# EAGLE schematic pirFadeDC (EAGLE 7.7.0)
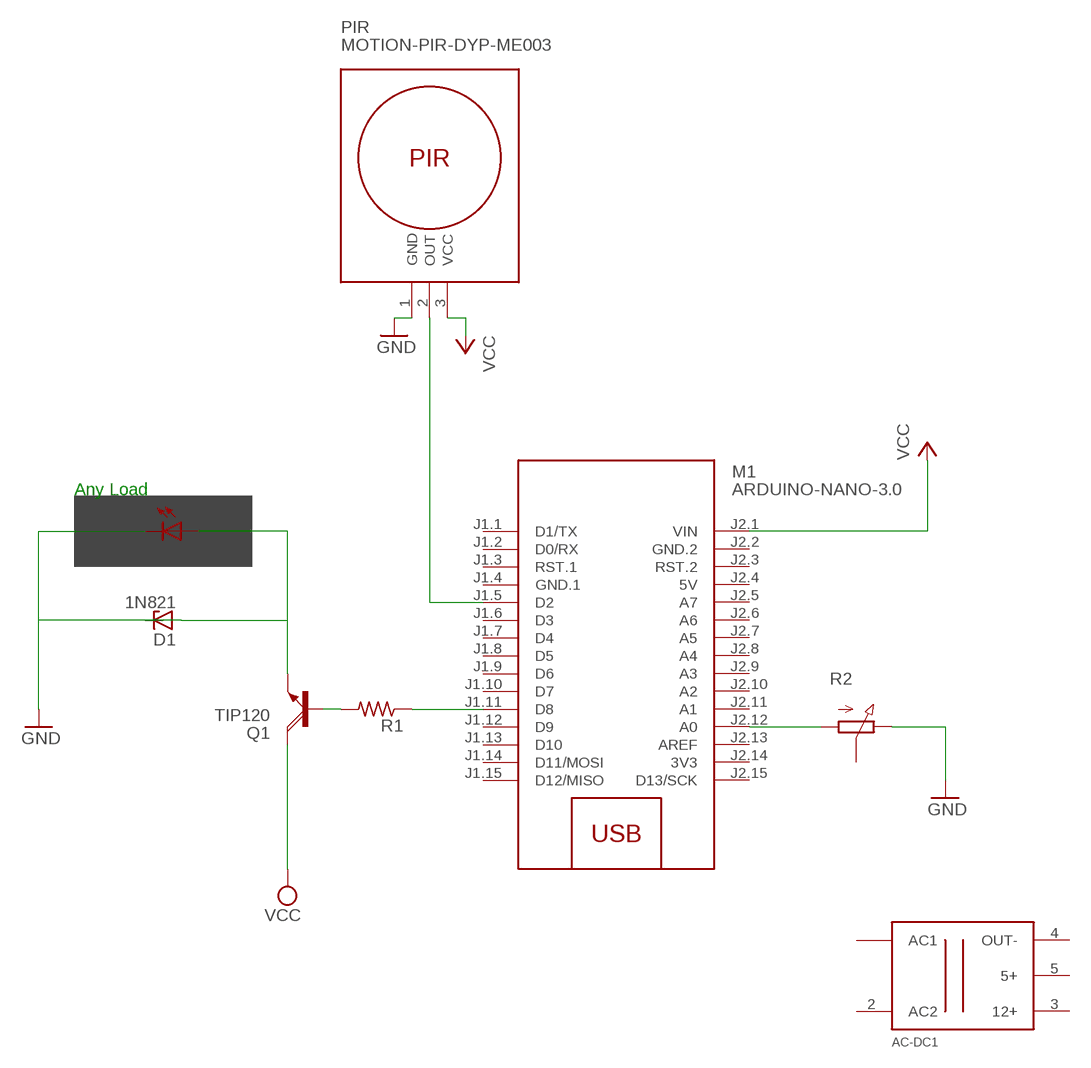
[diagram p0: schematic, sheet 1]

## Parts
AC-DC1  GENERIC_AC/DC  [AC/DC]
D1  1N821  [DO35Z10]
LED1  LED_ELD260  [LED_LD260]
M1  ARDUINO-NANO-3.0  [ARDUINO-NANO-3.0]
PIR  MOTION-PIR-DYP-ME003  [MOTION-PIR-DYP-ME003]
Q1  TIP120  [TO220AH]
R1  FLIPFLOP-RES  [0805-THM]
R2  PC25  [PC25]

## Nets
GND: D1.A D1.C LED1.A LED1.K(C) PIR.1(GND) Q1.E R2.E
N$1: M1.J1.11(D8) R1.1
N$2: Q1.B R1.2
N$3: M1.J2.12(A0) R2.A
N$4: M1.J1.5(D2) PIR.2(OUT)
VCC: M1.J2.1(VIN) PIR.3(VCC) Q1.C
Unconnected: AC-DC1.1(AC1) AC-DC1.2(AC2) AC-DC1.3(12+) AC-DC1.4(OUT-) AC-DC1.5(5+) M1.J1.1(D1/TX) M1.J1.2(D0/RX) M1.J1.3(RST.1) M1.J1.6(D3) M1.J1.7(D4) M1.J1.8(D5) M1.J1.9(D6) M1.J1.10(D7) M1.J1.12(D9) M1.J1.13(D10) M1.J1.14(D11/MOSI) M1.J1.15(D12/MISO) M1.J2.3(RST.2) M1.J2.5(A7) M1.J2.6(A6) M1.J2.7(A5) M1.J2.8(A4) M1.J2.9(A3) M1.J2.10(A2) M1.J2.11(A1) M1.J2.13(AREF) M1.J2.15(D13/SCK) R2.S

## Notes on the sheet
- Any Load

## Power pins joined to a net without a drawn wire
3V3: M1.J2.14(3V3)
5V: M1.J2.4(5V)
GND.1: M1.J1.4(GND.1)
GND.2: M1.J2.2(GND.2)

## Library data of the parts
AC-DC1 = mySymb:GENERIC_AC/DC
D1 = diode:1N821: Reference DIODE temperature compensated, 6,2 V
LED1 = eagle-ltspice:LED_E: LED Source: http://www.osram.convergy.de Source: www.luxeon.com Source: www.kingbright.com; SPICEMODEL: NONE; SPICEPREFIX: D; SPICETYPE: diode
M1 = diy-modules:ARDUINO-NANO-3.0: Arduino Nano 3.0
PIR = diy-modules:MOTION-PIR-DYP-ME003: PIR Motion Sensor Module DYP-ME003 based on BISS0001 pyroelectic detector
Q1 = transistor-power:TIP120: NPN DARLINGTON TRANSISTOR
R1 = adafruit:FLIPFLOP-RES: Flip Flop resistor An 0805 resistor inside a standard 1/4W 5% resistor. Makes for easy mods
R2 = pot-vitrohm:PC25: VITROHM POTENTIOMETER; MF: CLAROSTAT; MPN: 308NPC25KS; OC_FARNELL: 1440998; OC_NEWARK: 03F7518